# Altium project PCB_Project1.PrjPCB
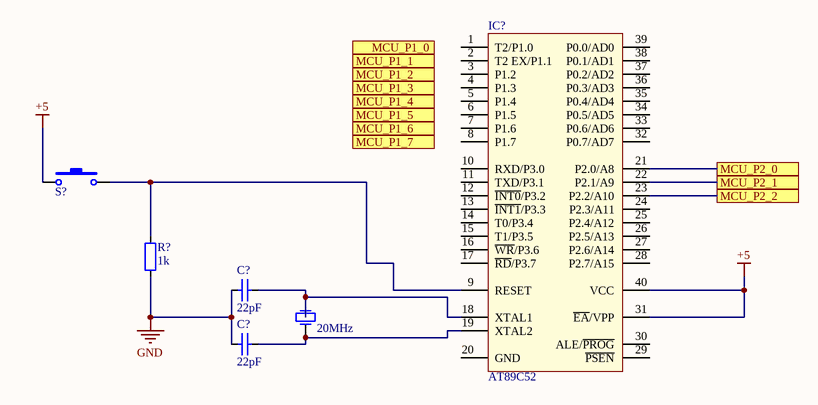
[diagram p0: [02]-MCU.SchDoc]
5 sheets, 30 parts. Net scope: flat (ports and power ports of the same name join across sheets).
Sheets:
  Sheet1.SchDoc
  [02]-MCU.SchDoc
  [03]-LED7SEG.SchDoc
  [04]-BUTTON.SchDoc
  [05]-POWER.SchDoc

## Sheet Sheet1.SchDoc
size A; Address1: chien nguyen

## Sheet [02]-MCU.SchDoc
size A

### Parts
(Parts that share a designator on the sheet are numbered #1, #2 ... from top to bottom, then left to right.)
C?#1  22pF  [CAP_0402]
C?#2  22pF  [CAP_0402]
IC?  AT89C52  [DIP40/W0.6]
R?#1  1k  [RES-1/2W]
S?  SW-SMD  [SW-SMD]  (value not drawn)
Y?  20MHz  [XTAL]

### Ports
MCU_P1_0, MCU_P1_1, MCU_P1_2, MCU_P1_3, MCU_P1_4, MCU_P1_5, MCU_P1_6, MCU_P1_7, MCU_P2_0, MCU_P2_1, MCU_P2_2

### Nets
+5: IC?.31(~{EA}/VPP) IC?.40(VCC) S?.1
GND: C?#1.1 C?#2.1 R?#1.1
NetC?#1_2: C?#1.2 IC?.18(XTAL1) Y?.2(OSC2)
NetC?#2_2: C?#2.2 IC?.19(XTAL2) Y?.1(OSC1)
NetIC?_9: IC?.9(RESET) R?#1.2 S?.2
NetIC?_21: IC?.21(P2.0/A8) ; port MCU_P2_0
NetIC?_22: IC?.22(P2.1/A9) ; port MCU_P2_1
NetIC?_23: IC?.23(P2.2/A10) ; port MCU_P2_2

Not connected (* = marked no-connect by the designer): IC? 1(T2/P1.0) 2(T2_EX/P1.1) 3(P1.2) 4(P1.3) 5(P1.4) 6(P1.5) 7(P1.6) 8(P1.7) 10(RXD/P3.0) 11(TXD/P3.1) 12(~{INT0}/P3.2) 13(~{INT1}/P3.3) 14(T0/P3.4) 15(T1/P3.5) 16(~{WR}/P3.6) 17(~{RD}/P3.7) 20(GND) 24(P2.3/A11) 25(P2.4/A12) 26(P2.5/A13) 27(P2.6/A14) 28(P2.7/A15) 29(~{PSEN}) 30(ALE/~{PROG}) 32(P0.7/AD7) 33(P0.6/AD6) 34(P0.5/AD5) 35(P0.4/AD4) 36(P0.3/AD3) 37(P0.2/AD2) 38(P0.1/AD1) 39(P0.0/AD0)

### Library data of the parts
C?#1 C?#2 = CapSMD: Capacitor; Value: 33p; Published: 8-Jun-2000; LatestRevisionDate: 17-Jul-2002; LatestRevisionNote: Re-released for DXP Platform.; PackageReference: RAD-0.3; Publisher: Altium Limited
IC? = AT89C52: Atmel AT89C52, 8k Byte Flash Memory , 40 Pin; Value: AT89C52
R?#1 = Resistor - DIP: Value: R1/4W - 1K
S? = SW-SMD: Switch; Published: 24-Mar-1999; LatestRevisionDate: 17-Jul-2002; LatestRevisionNote: Re-released for DXP Platform.; PackageReference: SPST-2; Publisher: Altium Limited
Y? = XTAL: Crystal Oscillator; Published: 8-Jun-2000; LatestRevisionDate: 17-Jul-2002; LatestRevisionNote: Re-released for DXP Platform.; PackageReference: R38; Publisher: Altium Limited

## Sheet [03]-LED7SEG.SchDoc
size A
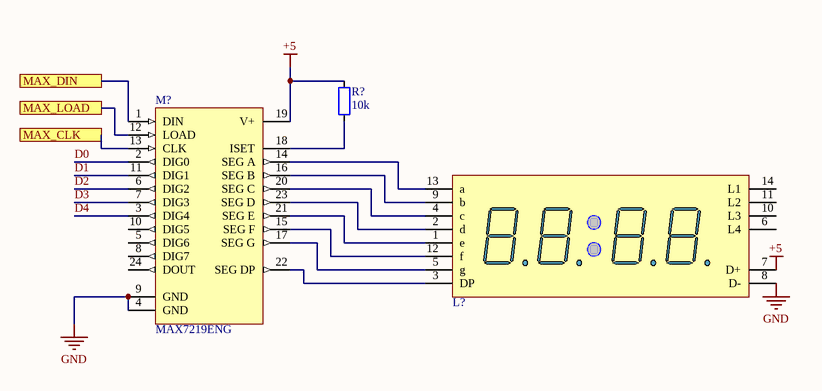
[diagram p1: [03]-LED7SEG.SchDoc]

### Parts
(Parts that share a designator on the sheet are numbered #1, #2 ... from top to bottom, then left to right.)
L?#1  Led 7 Seg 4 digit - Anode  [LED7SED-4-A]  (value not drawn)
M?  MAX7219ENG  [SO24]
R?#2  10k  [RES-1/2W]

### Ports
MAX_CLK, MAX_DIN, MAX_LOAD

### Nets
+5: L?#1.7(D+) M?.19(V+) R?#2.2
GND: L?#1.8(D-) M?.4(GND) M?.9(GND)
D0: M?.2(DIG0)
D1: M?.11(DIG1)
D2: M?.6(DIG2)
D3: M?.7(DIG3)
D4: M?.3(DIG4)
NetL?#1_1: L?#1.1(e) M?.21(SEG_E)
NetL?#1_2: L?#1.2(d) M?.23(SEG_D)
NetL?#1_3: L?#1.3(DP) M?.22(SEG_DP)
NetL?#1_4: L?#1.4(c) M?.20(SEG_C)
NetL?#1_5: L?#1.5(g) M?.17(SEG_G)
NetL?#1_9: L?#1.9(b) M?.16(SEG_B)
NetL?#1_12: L?#1.12(f) M?.15(SEG_F)
NetL?#1_13: L?#1.13(a) M?.14(SEG_A)
NetM?_1: M?.1(DIN) ; port MAX_DIN
NetM?_12: M?.12(LOAD) ; port MAX_LOAD
NetM?_13: M?.13(CLK) ; port MAX_CLK
NetM?_18: M?.18(ISET) R?#2.1

Not connected (* = marked no-connect by the designer): L?#1 6(L4) 10(L3) 11(L2) 14(L1); M? 5(DIG6) 8(DIG7) 10(DIG5) 24(DOUT)

### Library data of the parts
L?#1 = LED7SEG-4DIGIT-A
M? = MAX7219ENG: Serially Interfaced, 8-Digit LED Display Driver; Published: 16-Jan-2001; LatestRevisionDate: 29-May-2009; LatestRevisionNote: Component Body Added.; DatasheetVersion: Jul-1997; PackageVersion: 1997; PackageReference: NG24A; Publisher: Altium Limited; PackageDescription: DIP, 24-Pin, Row Spacing 7.62 mm, Pitch 2.54 mm; Code_JEDEC: MS-001-AF; ComponentLink1Description: Manufacturer Link; ComponentLink1URL: http://www.maxim-ic.com/; ComponentLink2Description: Datasheet; ComponentLink2URL: http://pdfserv.maxim-ic.com/en/ds/MAX7219-MAX7221.pdf
R?#2 = Resistor - DIP: Value: R1/4W - 1K

## Sheet [04]-BUTTON.SchDoc
size A
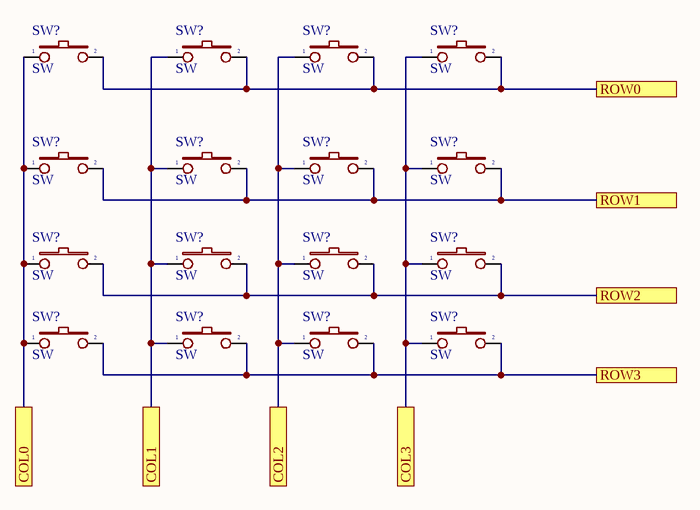
[diagram p2: [04]-BUTTON.SchDoc]

### Parts
(Parts that share a designator on the sheet are numbered #1, #2 ... from top to bottom, then left to right.)
SW?#1  SW  [SW2]
SW?#2  SW  [SW2]
SW?#3  SW  [SW2]
SW?#4  SW  [SW2]
SW?#5  SW  [SW2]
SW?#6  SW  [SW2]
SW?#7  SW  [SW2]
SW?#8  SW  [SW2]
SW?#9  SW  [SW2]
SW?#10  SW  [SW2]
SW?#11  SW  [SW2]
SW?#12  SW  [SW2]
SW?#13  SW  [SW2]
SW?#14  SW  [SW2]
SW?#15  SW  [SW2]
SW?#16  SW  [SW2]

### Ports
COL0, COL1, COL2, COL3, ROW0, ROW1, ROW2, ROW3

### Nets
NetSW?#1_1: SW?#1.1 SW?#5.1 SW?#9.1 SW?#13.1 ; port COL0
NetSW?#1_2: SW?#1.2 SW?#2.2 SW?#3.2 SW?#4.2 ; port ROW0
NetSW?#2_1: SW?#2.1 SW?#6.1 SW?#10.1 SW?#14.1 ; port COL1
NetSW?#3_1: SW?#3.1 SW?#7.1 SW?#11.1 SW?#15.1 ; port COL2
NetSW?#4_1: SW?#4.1 SW?#8.1 SW?#12.1 SW?#16.1 ; port COL3
NetSW?#5_2: SW?#5.2 SW?#6.2 SW?#7.2 SW?#8.2 ; port ROW1
NetSW?#9_2: SW?#9.2 SW?#10.2 SW?#11.2 SW?#12.2 ; port ROW2
NetSW?#13_2: SW?#13.2 SW?#14.2 SW?#15.2 SW?#16.2 ; port ROW3

### Library data of the parts
SW?#1-SW?#16 = SW2: Switch button 2 pin; Value: SW chip 2 pin

## Sheet [05]-POWER.SchDoc
size A
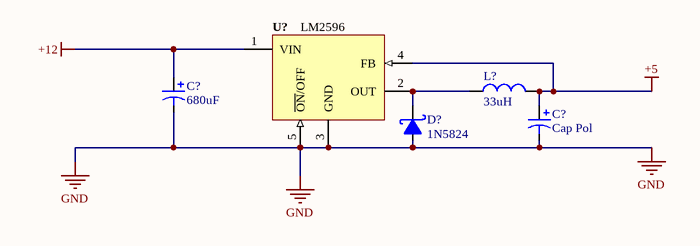
[diagram p3: [05]-POWER.SchDoc]

### Parts
(Parts that share a designator on the sheet are numbered #1, #2 ... from top to bottom, then left to right.)
C?#3  680uF  [C3MM]
C?#4  Cap Pol  [C3MM]
D?  1N5824  [D5A]
L?#2  33uH  [L/0.4]
U?  LM2596  [TO263]

### Nets
+5: C?#4.1 L?#2.2 U?.4(FB)
+12: C?#3.1 U?.1(VIN)
GND: C?#3.2 C?#4.2 D?.1(A) U?.3(GND) U?.5(~{ON}/OFF)
NetD?_2: D?.2(K) L?#2.1 U?.2(OUT)

### Library data of the parts
C?#3 C?#4 = Cap Pol: Polarized Capacitor (Axial); Published: 8-Jun-2000; LatestRevisionDate: 17-Jul-2002; LatestRevisionNote: Re-released for DXP Platform.; PackageReference: POLAR0.8; Publisher: Altium Limited
D? = 1N5822: Schottky Rectifiers; Value: Diode c?m 1N5408
L?#2 = Inductor: Value: 150 mH
U? = LM2596: Max Input Voltage: 12 V; Max Output Current: 3 (6.0 peak) A; Max Output Voltage: mV; Category: IC-Power; Min Input Voltage: mV; Min Output Voltage: mV; Mounting Technology: Surface Mount; Status: Unreleased; Supply Voltage: mV; Temperature Range: -40 to +125 degC

## Nets that join several sheets
+5: [02]-MCU (IC?.31 IC?.40 S?.1), [03]-LED7SEG (L?#1.7 M?.19 R?#2.2), [05]-POWER (C?#4.1 L?#2.2 U?.4)
GND: [02]-MCU (C?#1.1 C?#2.1 R?#1.1), [03]-LED7SEG (L?#1.8 M?.4 M?.9), [05]-POWER (5 pins)